# Altium schematic sheet 03_Sensors_and_WirelessCommunication.SchDoc
size A4; SheetNumber: 3; SheetTotal: 4
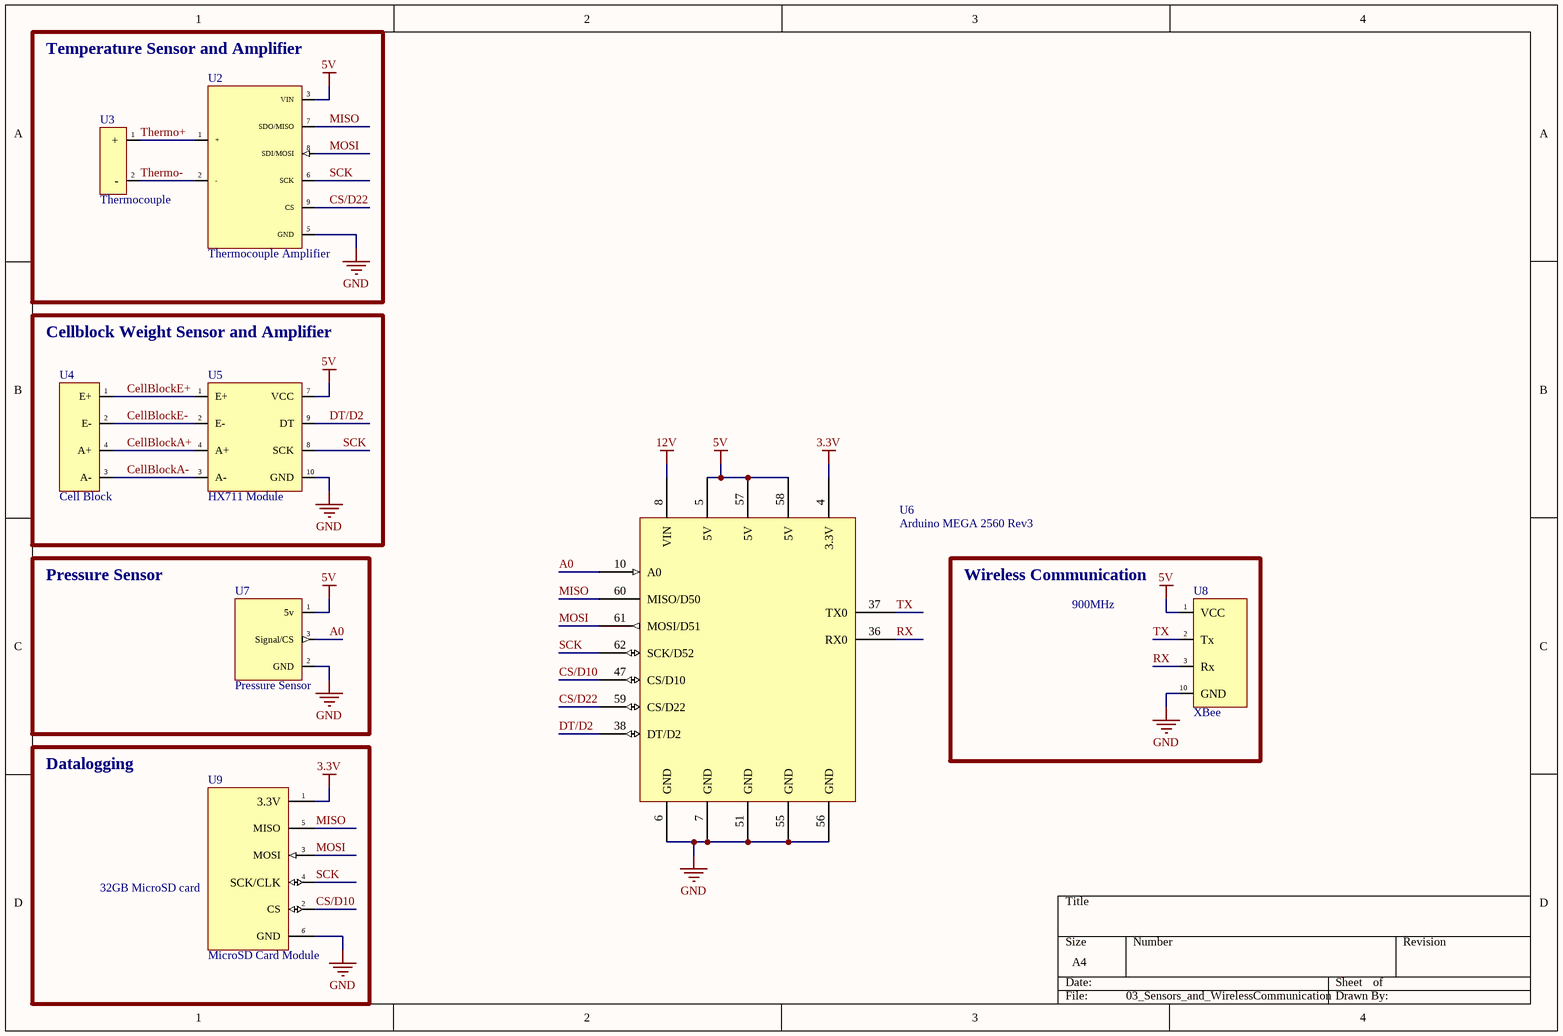
[diagram p0: 03_Sensors_and_WirelessCommunication.SchDoc]

## Parts
U2  Thermocouple Amplifier  [Thermocouple Amplifier]
U3  Thermocouple  [Thermocouple]
U4  Cell Block  [Cell Block]
U5  HX711 Module  [HX711 Module]
U6  Arduino MEGA 2560 Rev3  [Arduino MEGA 2560]
U7  Pressure Sensor  [Pressure Sensor]
U8  XBee  [XBee]
U9  MicroSD Card Module  [MicroSD Card Module]

## Blocks framed on the sheet
Temperature Sensor and Amplifier: U2 U3
Cellblock Weight Sensor and Amplifier: U4 U5
Pressure Sensor: U7
Wireless Communication: U8
Datalogging: U9

## Nets
3.3V: U6.4(3.3V) U9.1(3.3V)
5V: U2.3(VIN) U5.7(VCC) U6.5(5V) U6.57(5V) U6.58(5V) U7.1(5v) U8.1(VCC)
12V: U6.8(VIN)
GND: U2.5(GND) U5.10(GND) U6.6(GND) U6.7(GND) U6.51(GND) U6.55(GND) U6.56(GND) U7.2(GND) U8.10(GND) U9.6(GND)
A0: U6.10(A0) U7.3(Signal/CS)
CellBlockA+: U4.4(A+) U5.4(A+)
CellBlockA-: U4.3(A-) U5.3(A-)
CellBlockE+: U4.1(E+) U5.1(E+)
CellBlockE-: U4.2(E-) U5.2(E-)
CS/D10: U6.47(CS/D10) U9.2(CS)
CS/D22: U2.9(CS) U6.59(CS/D22)
DT/D2: U5.9(DT) U6.38(DT/D2)
MISO: U2.7(SDO/MISO) U6.60(MISO/D50) U9.5(MISO)
MOSI: U2.8(SDI/MOSI) U6.61(MOSI/D51) U9.3(MOSI)
RX: U6.36(RX0) U8.3(Rx)
SCK: U2.6(SCK) U5.8(SCK) U6.62(SCK/D52) U9.4(SCK/CLK)
Thermo+: U2.1(+) U3.1(+)
Thermo-: U2.2(-) U3.2(-)
TX: U6.37(TX0) U8.2(Tx)

## Notes on the sheet
- 900MHz
- 32GB MicroSD card

## Library data of the parts
U6 = Arduino MEGA 2560: The Arduino Mega 2560 is a microcontroller board based on the ATmega2560. It has 54 digital input/output pins (of which 15 can be used as PWM outputs), 16 analog inputs, 4 UARTs (hardware serial ports), a 16 MHz crystal oscillator, a USB connection, a power jack, an ICSP header, and a reset button. It contains everything needed to support the microcontroller; simply connect it to a computer with a USB cable or power it with a AC-to-DC adapter or battery to get started. The Mega 2560 board is compatible with most shields designed for the Uno and the former boards Duemilanove or Diecimila. / The Mega 2560 is an update to the Arduino Mega, which it replaces.